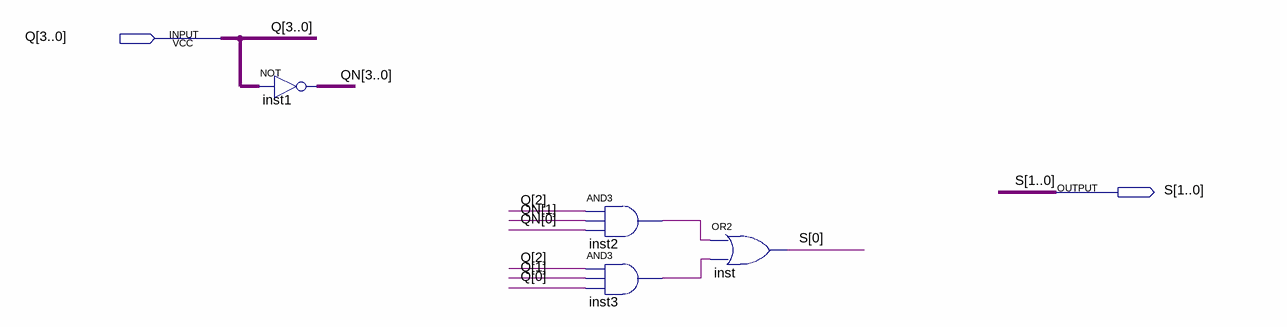
[diagram p0: schematic sheet]
// Quartus schematic S.bdf as structural Verilog: 4 symbols, 2 pins
module S (
  input  [3:0] Q,
  output [1:0] S
);

  wire inst2_out, inst3_out;
  wire [3:0] QN;

  assign QN = ~Q;  // NOT inst1, 4 bits wide
  and inst2 (inst2_out, Q[2], QN[1], QN[0]);
  and inst3 (inst3_out, Q[2], Q[1], Q[0]);
  or inst (S[0], inst2_out, inst3_out);
endmodule
